# Altium schematic sheet [03] - 28PINSCHEMATIC.SchDoc (part 2 of 3)
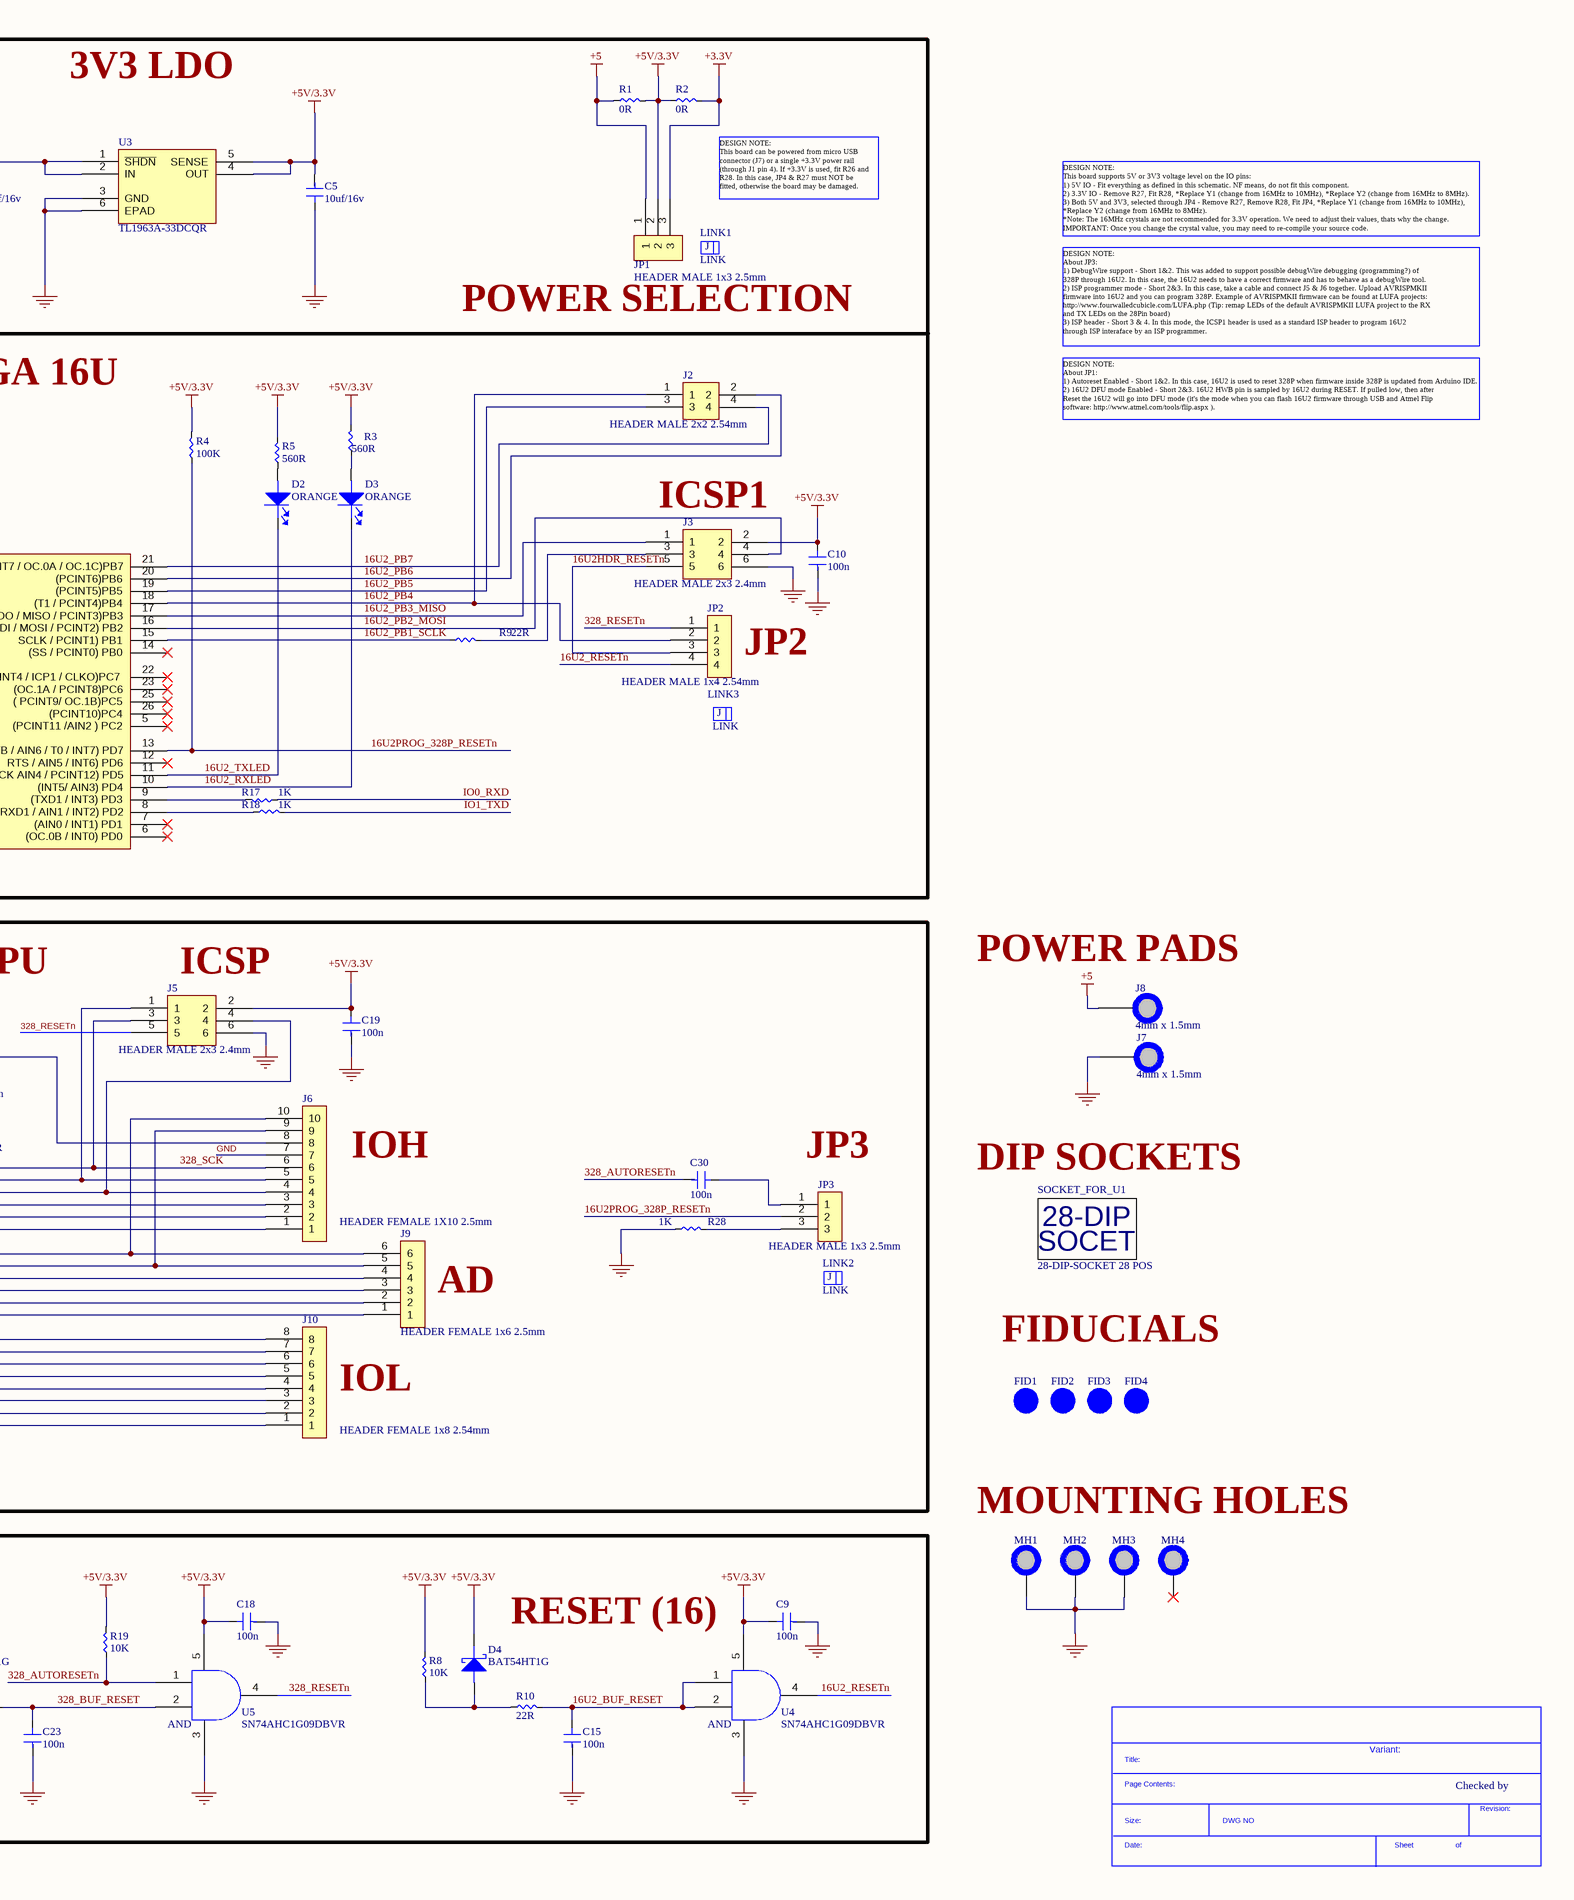
[diagram p2: [03] - 28PINSCHEMATIC.SchDoc, right]
## Library data of the parts
C1-C3 C7-C10 C14 C15 C18 C19 C21 C23-C25 C28-C32 = C2012X7R1H104M085AA: C Series 0805 0.1 uF 50 V ±20 % Tolerance X7R SMT Multilayer Ceramic Capacitor; Manufacturer: TDK; Capacitance: 100nF; Voltage Rating: 50V; Tolerance: 20%; Supplier 1: Digi-Key; Manufacturer Part Number: C2012X7R1H104M085AA; RoHS: Yes; Category: Ceramic Capacitors; Stock 1: 8415; Pricing 1: 1=0.13000, 10=0.09500, 50=0.05400, 100=0.04480, 500=0.03142, 1000=0.02601 (USD); Mount: Surface Mount; Case/Package: 0805; Number of Pins: 2; Case Code (Metric): 2012; Case Code (Imperial): 0805; Weight: 0.000194oz; Dielectric Material: Ceramic; Min Operating Temperature: -55°C; Max Operating Temperature: 125°C; Packaging: Tape and Reel; Package Quantity: 1; Voltage Rating (DC): 50V; Dielectric: X7R; Termination: SMD/SMT; Resistor Type: Ceramic; Series: C; Construction: Flat; Length: 2mm; Width: 0.049inch; Height: 0.85mm; Thickness: 0.037inch; Depth: 1.25mm; Lead Free: Lead Free; RoHS Compliant: Yes; ComponentLink1URL: https://datasheet.ciiva.com/6256/tdkmlcccaprange-6256917.pdf?src-supplier=Digi-Key; ComponentLink1Description: https://datasheet.ciiva.com/6256/tdkmlcccaprange-6256917.pdf?src-supplier=Digi-Key; ComponentLink2URL: https://datasheet.ciiva.com/6256/tdkmlcccaprange-6256919.pdf?src-supplier=Digi-Key; ComponentLink2Description: https://datasheet.ciiva.com/6256/tdkmlcccaprange-6256919.pdf?src-supplier=Digi-Key; Supplier Part Number 1: 445-7535-1-ND
C4-C6 C20 C22 = C2012X5R1C106M125AC: CERAMIC CAPACITOR, 10UF, 16V, X5R, 20%, 0805, FULL REEL; Product Range:C Series; Capacitance:10 F; Capacitance Tolerance: 20%; Dielectric Characteristic:X5R; Voltage Rating:16V; Ceramic Capacitor Case:0805 [2012 Metric]; MSL:- ;RoHS Compliant: Yes; Manufacturer: TDK; Supplier 1: Farnell; Manufacturer Part Number: C2012X5R1C106M125AC; RoHS: Yes; Category: Ceramic Capacitors; Pricing 1: 5=0.27200, 50=0.09480, 250=0.08030, 500=0.07090, 1000=0.06220, 2000=0.04880, 10000=0.04830, 20000=0.04180 (GBP); Mount: Surface Mount; Case/Package: 0805; Number of Pins: 2; Case Code (Metric): 2012; Case Code (Imperial): 0805; Weight: 0.000194oz; Dielectric Material: Ceramic; Min Operating Temperature: -55°C; Max Operating Temperature: 85°C; Capacitance: 10uF; Tolerance: 20%; Voltage Rating: 16V; Packaging: Tape and Reel; Package Quantity: 1; Voltage Rating (DC): 16V; Dielectric: X5R; Termination: SMD/SMT; Resistor Type: Ceramic; Series: C; Length: 0.079inch; Width: 0.049inch; Height: 1.25mm; Thickness: 0.057inch; Depth: 1.25mm; Lead Free: Lead Free; RoHS Compliant: Yes; ComponentLink1URL: https://datasheet.ciiva.com/23803/1796654-23803022.pdf?src-supplier=Newark; ComponentLink1Description: https://datasheet.ciiva.com/23803/1796654-23803022.pdf?src-supplier=Newark; ComponentLink2URL: https://datasheet.ciiva.com/22725/1913358-22725558.pdf?src-supplier=Element14; ComponentLink2Description: https://datasheet.ciiva.com/22725/1913358-22725558.pdf?src-supplier=Element14; ComponentLink3URL: https://datasheet.ciiva.com/6252/tdkmlcccaprange-6252105.pdf?src-supplier=Digi-Key; ComponentLink3Description: https://datasheet.ciiva.com/6252/tdkmlcccaprange-6252105.pdf?src-supplier=Digi-Key; ComponentLink4URL: https://datasheet.ciiva.com/6289/tdkmlcccaprange-6289238.pdf?src-supplier=Digi-Key; ComponentLink4Description: https://datasheet.ciiva.com/6289/tdkmlcccaprange-6289238.pdf?src-supplier=Digi-Key; ComponentLink5URL: https://datasheet.ciiva.com/6252/tdkmlcccaprange-6252108.pdf?src-supplier=Digi-Key; ComponentLink5Description: https://datasheet.ciiva.com/6252/tdkmlcccaprange-6252108.pdf?src-supplier=Digi-Key; Supplier Part Number 1: 2525134
C11 C12 = EEE-1CA101WP: Cap Aluminum 100uF 16V 20% (6.3 X 5.4mm) SMD 70mA 1000 hr 85°C T/R; Manufacturer: Panasonic; Life (Hours): 1000Hour; Leakage Current: 3uA; Supplier 1: Future Electronics; Manufacturer Part Number: EEE-1CA101WP; RoHS: Yes; Category: Aluminum Electrolytic Capacitors; Stock 1: 49000; Pricing 1: 1000=0.12400, 3000=0.12100, 5000=0.11900, 15000=0.11500, 25000=0.11200 (USD); Mount: Surface Mount,PCB; Case/Package: Radial; Contact Plating: Tin; Min Operating Temperature: -40°C; Max Operating Temperature: 85°C; Capacitance: 100uF; Tolerance: 20%; Voltage Rating: 16V; Ripple Current: 70mA; Voltage Rating (DC): 16V; Packaging: Tape and Reel; Package Quantity: 1000; Ripple Current (AC): 70mA; Termination: SMD/SMT; Voltage: 16V; Series: S; Construction: Cylindrical; Diameter: 6.3mm; Length: 5.5mm; Height: 5.4mm; Height - Seated (Max): 0.213inch; Ratings: AEC-Q200; Radiation Hardening: No; Lead Free: Lead Free; RoHS Compliant: Yes; ComponentLink1URL: https://datasheet.ciiva.com/36525/1355583-36525976.pdf?src-supplier=Jameco; ComponentLink1Description: https://datasheet.ciiva.com/36525/1355583-36525976.pdf?src-supplier=Jameco; ComponentLink2URL: https://datasheet.ciiva.com/24022/aba0000ce2-40801-24022853.pdf?src-supplier=Mouser; ComponentLink2Description: https://datasheet.ciiva.com/24022/aba0000ce2-40801-24022853.pdf?src-supplier=Mouser; ComponentLink3URL: https://datasheet.ciiva.com/14600/70255710-14600124.pdf?src-supplier=Allied+Electronics; ComponentLink3Description: https://datasheet.ciiva.com/14600/70255710-14600124.pdf?src-supplier=Allied+Electronics; ComponentLink4URL: https://datasheet.ciiva.com/11680/aba0000ce2-11680765.pdf?src-supplier=Avnet; ComponentLink4Description: https://datasheet.ciiva.com/11680/aba0000ce2-11680765.pdf?src-supplier=Avnet; ComponentLink5URL: https://datasheet.ciiva.com/2983/aba0000ce2-2983909.pdf?src-supplier=Avnet; ComponentLink5Description: https://datasheet.ciiva.com/2983/aba0000ce2-2983909.pdf?src-supplier=Avnet; ComponentLink6URL: https://datasheet.ciiva.com/30194/11aba0000ce2-30194491.pdf?src-supplier=Onlinecomponents.com; ComponentLink6Description: https://datasheet.ciiva.com/30194/11aba0000ce2-30194491.pdf?src-supplier=Onlinecomponents.com; Supplier Part Number 1: 7028587
C13 = C2012X5R1E105K125AA: CAP CER 1UF 25V X5R 0805; Manufacturer: TDK; Dielectric Material: Ceramic; Tolerance: 10%; Supplier 1: Arrow Electronics; Manufacturer Part Number: C2012X5R1E105K125AA; RoHS: Yes; Category: Ceramic Capacitors; Stock 1: 86000; Pricing 1: 2000=0.03530, 4000=0.03050, 10000=0.02970, 14000=0.02630, 50000=0.02620 (USD); Mount: Surface Mount; Case/Package: 0805; Number of Pins: 2; Case Code (Metric): 2012; Case Code (Imperial): 0805; Weight: 0.000194oz; Min Operating Temperature: -55°C; Max Operating Temperature: 85°C; Package Quantity: 2000; Capacitance: 1uF; Voltage Rating: 25V; Packaging: Tape and Reel; Voltage Rating (DC): 25V; Dielectric: X5R; Termination: SMD/SMT; Resistor Type: Ceramic; Voltage: 25V; Series: C; Construction: Flat; Length: 2mm; Width: 0.049inch; Height: 1.25mm; Thickness: 0.057inch; Depth: 1.25mm; Radiation Hardening: No; Reach SVHC Compliant: Yes; Lead Free: Lead Free; RoHS Compliant: Yes; ComponentLink1URL: https://datasheet.ciiva.com/16449/e412-c-16449595.pdf?src-supplier=Future+Electronics; ComponentLink1Description: https://datasheet.ciiva.com/16449/e412-c-16449595.pdf?src-supplier=Future+Electronics; ComponentLink2URL: https://datasheet.ciiva.com/28602/1744655-28602171.pdf?src-supplier=Element14; ComponentLink2Description: https://datasheet.ciiva.com/28602/1744655-28602171.pdf?src-supplier=Element14; ComponentLink3URL: https://datasheet.ciiva.com/15192/getdatasheetpartid-726707-15192140.pdf?src-supplier=Verical; ComponentLink3Description: https://datasheet.ciiva.com/15192/getdatasheetpartid-726707-15192140.pdf?src-supplier=Verical; Supplier Part Number 1: C2012X5R1E105K125AA
C16 C17 C26 C27 = C0805C180J5GACAUTO: .050 X .050 C.L. FEMALE IDC ASSE; Manufacturer: KEMET; Supplier 1: Digi-Key; Manufacturer Part Number: C0805C180J5GACAUTO; RoHS: Yes; Category: Ceramic Capacitors; Stock 1: 1163; Pricing 1: 1=0.18000, 10=0.12600, 50=0.07160, 100=0.05930, 500=0.04158, 1000=0.03443 (USD); RoHS Compliant: Yes; Supplier Part Number 1: 399-C0805C180J5GACAUTOCT-ND
D1 = LSL29K-G1J2-1-Z: Smartled Red Clear Lc; Manufacturer: Osram Opto; Lens Color: White,Colorless; Lens Style: Flat,Diffused,Colorless,Rectangular; Viewing Angle: 160°; Forward Current: 20mA; Forward Voltage: 2.2V; Luminous Intensity: 7.1mcd; Test Current: 2mA; Dominant Wavelength: 630nm; Luminous Flux: 0.017lm; Number of LEDs: 1; Reverse Voltage: 12V; Lens Transparency: Diffused; Lens Size: 0.8mm; Supplier 1: Avnet; Manufacturer Part Number: LSL29K-G1J2-1-Z; RoHS: Yes; Category: LEDs; Pricing 1: 15000=0.06572, 25000=0.06405, 40000=0.06237, 75000=0.06070, 150000=0.05902, 750000=0.05735, 1500000=0.05567 (USD); Mount: Surface Mount; Case/Package: 0603; Number of Pins: 2; Color: Red; Case Code (Metric): 1608; Case Code (Imperial): 0603; Contact Plating: Tin,Matte; Min Operating Temperature: -40°C; Max Operating Temperature: 100°C; Package Quantity: 5000; Packaging: Tape and Reel; Illumination Color: Red; Series: SMARTLED® 0603; Number of Elements: 1; Length: 1.7mm; Width: 0.8mm; Height: 0.65mm; Depth: 0.8mm; Radiation Hardening: No; ComponentLink1URL: https://datasheet.ciiva.com/2112/00077099-0-2112845.pdf?src-supplier=Digi-Key; ComponentLink1Description: https://datasheet.ciiva.com/2112/00077099-0-2112845.pdf?src-supplier=Digi-Key; ComponentLink2URL: https://datasheet.ciiva.com/2112/00077099-0-2112844.pdf?src-supplier=Digi-Key; ComponentLink2Description: https://datasheet.ciiva.com/2112/00077099-0-2112844.pdf?src-supplier=Digi-Key; ComponentLink3URL: https://datasheet.ciiva.com/2112/00077099-0-2112846.pdf?src-supplier=Digi-Key; ComponentLink3Description: https://datasheet.ciiva.com/2112/00077099-0-2112846.pdf?src-supplier=Digi-Key; Supplier Part Number 1: Q65110A1757
D2 D3 D6 = SML-311DTT86: ROHM SML-311DTT86; SML-31 Series Orange LED; 605 nm 1608(0603); Rectangle Lens; Lens Color: Colorless,Clear; Forward Current: 2mA; Forward Voltage: 1.8V; Luminous Intensity: 2.5mcd; Viewing Angle: 140°; Lens Style: Diffused,Colorless,Rectangular,Clear; Dominant Wavelength: 605nm; Lens Transparency: Clear; Wavelength: 611nm; Number of LEDs: 1; Supplier 1: Digi-Key; Manufacturer: Rohm; Manufacturer Part Number: SML-311DTT86; RoHS: Yes; Category: LEDs; Stock 1: 44311; Pricing 1: 1=0.40000, 10=0.26200, 100=0.17510, 500=0.12112, 1000=0.10094 (USD); Mount: Surface Mount; Case/Package: 0603; Number of Pins: 2; Color: Orange; Case Code (Metric): 1608; Case Code (Imperial): 0603; Min Operating Temperature: -30°C; Max Operating Temperature: 85°C; Package Quantity: 1; Illumination Color: Orange; Packaging: Tape and Reel; Test Current: 2mA; Series: -; Length: 1.6mm; Width: 0.8mm; Height: 0.9mm; Radiation Hardening: No; Lead Free: Lead Free; RoHS Compliant: Yes; ComponentLink1URL: https://datasheet.ciiva.com/11774/0900766b80df3a77-11774225.pdf?src-supplier=Rs; ComponentLink1Description: https://datasheet.ciiva.com/11774/0900766b80df3a77-11774225.pdf?src-supplier=Rs; ComponentLink2URL: https://datasheet.ciiva.com/2110/sml-311series-2110838.pdf?src-supplier=Digi-Key; ComponentLink2Description: https://datasheet.ciiva.com/2110/sml-311series-2110838.pdf?src-supplier=Digi-Key; ComponentLink3URL: https://datasheet.ciiva.com/2110/sml-311series-2110839.pdf?src-supplier=Digi-Key; ComponentLink3Description: https://datasheet.ciiva.com/2110/sml-311series-2110839.pdf?src-supplier=Digi-Key; ComponentLink4URL: https://datasheet.ciiva.com/2110/sml-311series-2110840.pdf?src-supplier=Digi-Key; ComponentLink4Description: https://datasheet.ciiva.com/2110/sml-311series-2110840.pdf?src-supplier=Digi-Key; ComponentLink5URL: https://datasheet.ciiva.com/16388/sml-31-16388237.pdf?src-supplier=Future+Electronics; ComponentLink5Description: https://datasheet.ciiva.com/16388/sml-31-16388237.pdf?src-supplier=Future+Electronics; Supplier Part Number 1: 511-1303-1-ND
D4 D5 = BAT54HT1G: Diode Schottky 30V 200MA SOD323; Manufacturer: Rochester Electronics; Polarity: Standard; Capacitance: 10pF; Supplier 1: DigiKey Marketplace; Manufacturer Part Number: BAT54HT1G; Category: Rectifier Diodes; Pricing 1: 1=1.00000 (USD); Number of Pins: 2; Packaging: Bulk; Voltage Rating (DC): 30V; Current Rating: 200mA; Output Current: 200mA; Reach SVHC Compliant: Yes; Lead Free: Lead Free; Halogen Free: Halogen Free; Supplier Part Number 1: 2156-BAT54HT1G-ND
FB1-FB3 = MPZ2012S221AT000: 0805 ±25% 220Ω @100MHz 3A 40mΩ; Manufacturer: TDK; Core Material: Ferrite; Impedance: 220R; DC Resistance (DCR): 40mR; Test Frequency: 100MHz; Number of Lines: 1; Supplier 1: Digi-Key; Manufacturer Part Number: MPZ2012S221AT000; RoHS: Yes; Category: Ferrite Beads and Chips; Pricing 1: 1=0.11000, 10=0.09200, 25=0.08320, 50=0.06100, 100=0.05270, 250=0.04160, 500=0.03512, 1000=0.02957 (USD); Mount: Surface Mount; Case/Package: 0805; Case Code (Metric): 2012; Case Code (Imperial): 0805; Weight: 0.000194oz; Min Operating Temperature: -55°C; Max Operating Temperature: 125°C; Packaging: Tape and Reel; Package Quantity: 1; Current Rating: 3A; Tolerance: 25%; Max DC Current: 3A; Termination: SMD/SMT; Series: MPZ; Max Current Rating: 3A; Length: 0.079inch; Width: 0.049inch; Height: 0.85mm; Depth: 1.25mm; Reach SVHC Compliant: Yes; Lead Free: Lead Free; RoHS Compliant: Yes; ComponentLink1URL: https://datasheet.ciiva.com/46381/1750041-46381647.pdf?src-supplier=Element14; ComponentLink1Description: https://datasheet.ciiva.com/46381/1750041-46381647.pdf?src-supplier=Element14; ComponentLink2URL: https://datasheet.ciiva.com/46634/beads-commercial-power-mpz-en-46634582.pdf?src-supplier=Digi-Key; ComponentLink2Description: https://datasheet.ciiva.com/46634/beads-commercial-power-mpz-en-46634582.pdf?src-supplier=Digi-Key; ComponentLink3URL: https://datasheet.ciiva.com/46634/beads-commercial-power-mpz-en-46634586.pdf?src-supplier=Digi-Key; ComponentLink3Description: https://datasheet.ciiva.com/46634/beads-commercial-power-mpz-en-46634586.pdf?src-supplier=Digi-Key; ComponentLink4URL: https://datasheet.ciiva.com/48682/beads-commercial-power-mpz-en-48682507.pdf?src-supplier=Avnet; ComponentLink4Description: https://datasheet.ciiva.com/48682/beads-commercial-power-mpz-en-48682507.pdf?src-supplier=Avnet; Supplier Part Number 1: 445-MPZ2012S221AT000DKR-ND
FID1-FID4 = Fit 1mm: Fiducial 40mm Diameter 120mil Mask
J1 J10 = M20-7820842: 2.54mm (0.1") Pitch SIL Vertical PC Tail Socket Assembly, selective gold + tin, 8 contacts; Manufacturer: Harwin; Number of Positions: 8; Connector Type: Receptacle; Max Current Rating: 3A; Contact Resistance: 20mR; Supplier 1: Mouser; Manufacturer Part Number: M20-7820842; RoHS: Yes; Category: Headers and Wire Housings; Stock 1: 3750; Pricing 1: 1=1.43000, 10=1.15000, 50=1.15000, 100=1.15000, 1000=0.88300, 10000=0.68700 (USD); Mount: Through Hole; Case/Package: SIL; Contact Plating: Tin,Gold; Color: Black; Contact Material: Bronze; Housing Material: Polyamide; Housing Color: Black; Weight: 0.025397oz; Min Operating Temperature: -40°C; Max Operating Temperature: 105°C; Number of Rows: 1; Package Quantity: 29; Packaging: Rail/Tube; Termination: Solder; Number of Contacts: 8; Orientation: Straight; Gender: Female; Series: M20; Contact Type: Female Socket; Contact Gender: Female; Length: 20.72mm; Pitch: 2.54mm; Depth: 2.5mm; Radiation Hardening: No; RoHS Compliant: Yes; ComponentLink1URL: https://datasheet.ciiva.com/9480/m20-782-9480074.pdf?src-supplier=Avnet; ComponentLink1Description: https://datasheet.ciiva.com/9480/m20-782-9480074.pdf?src-supplier=Avnet; Supplier Part Number 1: 855-M20-7820842
J2 = 68602-204HLF: Conn Unshrouded Header HDR 4 POS 2.54mm Solder ST Top Entry Thru-Hole BergStik® Bulk; Manufacturer: Amphenol ICC; Supplier 1: Mouser; Manufacturer Part Number: 68602-204HLF; RoHS: Yes; Supplier Part Number 1: 649-68602-204HLF
J3 J5 = 67997-106HLF: Conn Unshrouded Header HDR 6 POS 2.54mm Solder ST Top Entry Thru-Hole BergStik® Bulk; Manufacturer: Amphenol ICC / FCI; Supplier 1: Avnet; Manufacturer Part Number: 67997-106HLF; RoHS: No; Category: Headers and Wire Housings; Stock 1: 8823; ComponentLink1URL: http://uk.rs-online.com/webdocs/1450/0900766b81450b8b.pdf?src-supplier=Rs; ComponentLink1Description: http://uk.rs-online.com/webdocs/1450/0900766b81450b8b.pdf?src-supplier=Rs; ComponentLink2URL: https://cdn.amphenol-icc.com/media/wysiwyg/files/drawing/67996.pdf?src-supplier=Onlinecomponents.com; ComponentLink2Description: https://cdn.amphenol-icc.com/media/wysiwyg/files/drawing/67996.pdf?src-supplier=Onlinecomponents.com; ComponentLink3URL: https://cdn.amphenol-icc.com/media/wysiwyg/files/drawing/67996.pdf?src-supplier=Digi-Key; ComponentLink3Description: https://cdn.amphenol-icc.com/media/wysiwyg/files/drawing/67996.pdf?src-supplier=Digi-Key; ComponentLink4URL: http://components.arrow.com/part/dataview/41913658S7633350N8314?src-supplier=Arrow+Electronics; ComponentLink4Description: http://components.arrow.com/part/dataview/41913658S7633350N8314?src-supplier=Arrow+Electronics; ComponentLink5URL: http://www.farnell.com/datasheets/1876884.pdf?src-supplier=Newark; ComponentLink5Description: http://www.farnell.com/datasheets/1876884.pdf?src-supplier=Newark; ComponentLink6URL: https://cdn.amphenol-icc.com/media/wysiwyg/files/drawing/67996.pdf?src-supplier=Allied+Electronics; ComponentLink6Description: https://cdn.amphenol-icc.com/media/wysiwyg/files/drawing/67996.pdf?src-supplier=Allied+Electronics; ComponentLink7URL: https://cdn.amphenol-icc.com/media/wysiwyg/files/drawing/67996.pdf?src-supplier=Mouser; ComponentLink7Description: https://cdn.amphenol-icc.com/media/wysiwyg/files/drawing/67996.pdf?src-supplier=Mouser; ComponentLink8URL: http://www.farnell.com/datasheets/1876884.pdf?src-supplier=Farnell; ComponentLink8Description: http://www.farnell.com/datasheets/1876884.pdf?src-supplier=Farnell; ComponentLink9URL: https://cdn.amphenol-icc.com/media/wysiwyg/files/drawing/67996.pdf?src-supplier=Avnet; ComponentLink9Description: https://cdn.amphenol-icc.com/media/wysiwyg/files/drawing/67996.pdf?src-supplier=Avnet; ComponentLink10URL: https://cdn.amphenol-icc.com/media/wysiwyg/files/drawing/67996.pdf?src-supplier=TTI; ComponentLink10Description: https://cdn.amphenol-icc.com/media/wysiwyg/files/drawing/67996.pdf?src-supplier=TTI; ComponentLink11URL: https://cdn.amphenol-icc.com/media/wysiwyg/files/drawing/67996.pdf?src-supplier=Heilind+Electronics; ComponentLink11Description: https://cdn.amphenol-icc.com/media/wysiwyg/files/drawing/67996.pdf?src-supplier=Heilind+Electronics; Supplier Part Number 1: 67997-106HLF
J4 = 10118193-0001LF: FCI Right Angle Surface Mount Mount Female USB Connector; 100 V ac; 1.8A; Manufacturer: Amphenol ICC / FCI; Supplier 1: Rs; Manufacturer Part Number: 10118193-0001LF; RoHS: No; Category: USB Connectors; Stock 1: 1; ComponentLink1URL: http://uk.rs-online.com/webdocs/1450/0900766b814507f1.pdf?src-supplier=Rs; ComponentLink1Description: http://uk.rs-online.com/webdocs/1450/0900766b814507f1.pdf?src-supplier=Rs; ComponentLink2URL: http://www.amphenol-icc.com/media/wysiwyg/files/drawing/10118193.pdf?src-supplier=Digi-Key; ComponentLink2Description: http://www.amphenol-icc.com/media/wysiwyg/files/drawing/10118193.pdf?src-supplier=Digi-Key; ComponentLink3URL: https://cdn.amphenol-icc.com/media/wysiwyg/files/documentation/datasheet/inputoutput/io_usb_micro.pdf?src-supplier=Digi-Key; ComponentLink3Description: https://cdn.amphenol-icc.com/media/wysiwyg/files/documentation/datasheet/inputoutput/io_usb_micro.pdf?src-supplier=Digi-Key; ComponentLink4URL: https://cdn.amphenol-icc.com/media/wysiwyg/files/documentation/datasheet/inputoutput/io_usb_micro.pdf?src-supplier=Onlinecomponents.com; ComponentLink4Description: https://cdn.amphenol-icc.com/media/wysiwyg/files/documentation/datasheet/inputoutput/io_usb_micro.pdf?src-supplier=Onlinecomponents.com; ComponentLink5URL: https://cdn.amphenol-icc.com/media/wysiwyg/files/documentation/datasheet/inputoutput/io_usb_micro.pdf?src-supplier=Verical; ComponentLink5Description: https://cdn.amphenol-icc.com/media/wysiwyg/files/documentation/datasheet/inputoutput/io_usb_micro.pdf?src-supplier=Verical; ComponentLink6URL: https://cdn.amphenol-icc.com/media/wysiwyg/files/documentation/datasheet/inputoutput/io_usb_micro.pdf?src-supplier=Allied+Electronics; ComponentLink6Description: https://cdn.amphenol-icc.com/media/wysiwyg/files/documentation/datasheet/inputoutput/io_usb_micro.pdf?src-supplier=Allied+Electronics; ComponentLink7URL: https://cdn.amphenol-icc.com/media/wysiwyg/files/documentation/datasheet/inputoutput/io_usb_micro.pdf?src-supplier=Mouser; ComponentLink7Description: https://cdn.amphenol-icc.com/media/wysiwyg/files/documentation/datasheet/inputoutput/io_usb_micro.pdf?src-supplier=Mouser; ComponentLink8URL: https://cdn.amphenol-icc.com/media/wysiwyg/files/documentation/datasheet/inputoutput/io_usb_micro.pdf?src-supplier=Avnet; ComponentLink8Description: https://cdn.amphenol-icc.com/media/wysiwyg/files/documentation/datasheet/inputoutput/io_usb_micro.pdf?src-supplier=Avnet; ComponentLink9URL: https://cdn.amphenol-icc.com/media/wysiwyg/files/documentation/datasheet/inputoutput/io_usb_micro.pdf?src-supplier=Arrow+Electronics; ComponentLink9Description: https://cdn.amphenol-icc.com/media/wysiwyg/files/documentation/datasheet/inputoutput/io_usb_micro.pdf?src-supplier=Arrow+Electronics; ComponentLink10URL: https://cdn.amphenol-icc.com/media/wysiwyg/files/documentation/datasheet/inputoutput/io_usb_micro.pdf?src-supplier=Rs; ComponentLink10Description: https://cdn.amphenol-icc.com/media/wysiwyg/files/documentation/datasheet/inputoutput/io_usb_micro.pdf?src-supplier=Rs; ComponentLink11URL: https://cdn.amphenol-icc.com/media/wysiwyg/files/documentation/datasheet/inputoutput/io_usb_micro.pdf?src-supplier=TTI; ComponentLink11Description: https://cdn.amphenol-icc.com/media/wysiwyg/files/documentation/datasheet/inputoutput/io_usb_micro.pdf?src-supplier=TTI; ComponentLink12URL: https://cdn.amphenol-icc.com/media/wysiwyg/files/documentation/datasheet/inputoutput/io_usb_micro.pdf?src-supplier=TME; ComponentLink12Description: https://cdn.amphenol-icc.com/media/wysiwyg/files/documentation/datasheet/inputoutput/io_usb_micro.pdf?src-supplier=TME; ComponentLink13URL: https://cdn.amphenol-icc.com/media/wysiwyg/files/documentation/datasheet/inputoutput/io_usb_micro.pdf?src-supplier=Heilind+Electronics; ComponentLink13Description: https://cdn.amphenol-icc.com/media/wysiwyg/files/documentation/datasheet/inputoutput/io_usb_micro.pdf?src-supplier=Heilind+Electronics; Supplier Part Number 1: 8632989
J6 = M20-7821046: 2.54mm (0.1") Pitch SIL Vertical PC Tail Socket Assembly, tin, 10 contacts; Manufacturer: Harwin; Current Rating: 3A; Connector Type: Receptacle; Number of Positions: 10; Contact Resistance: 20mR; Insulation Resistance: 1MR; Voltage Rating: 1kV; Mating Cycles: 50; Mated Stacking Heights: 12.63mm; Hole Diameter: 0.8mm; Supplier 1: Rs; Manufacturer Part Number: M20-7821046; RoHS: Yes; Category: Headers and Wire Housings; Stock 1: 515; Mount: Through Hole; Case/Package: SIL; Color: Black; Contact Plating: Tin; Contact Material: Bronze; Housing Material: Nylon; Housing Color: Black; Contact Finish - Mating: TIN; Insulation Color: Black; Insulation Material: Nylon; Contact Shape: Square; Min Operating Temperature: -40°C; Max Operating Temperature: 105°C; Packaging: Rail/Tube; Number of Rows: 1; Package Quantity: 23; Termination: Solder; Number of Contacts: 10; Gender: Receptacle; Series: M20; Contact Type: Female Socket; Max Current Rating: 3A; Orientation: Straight; Fastening Type: Pull; Contact Gender: Female; Length: 25.8mm; Pitch: 2.54mm; Depth: 2.5mm; Lead Pitch: 2.54mm; Radiation Hardening: No; RoHS Compliant: Yes; Reach SVHC Compliant: Yes; Flammability Rating: UL94 V-0; ComponentLink1URL: https://datasheet.ciiva.com/26899/getdatasheetpartid-559226-26899379.pdf?src-supplier=Verical; ComponentLink1Description: https://datasheet.ciiva.com/26899/getdatasheetpartid-559226-26899379.pdf?src-supplier=Verical; ComponentLink2URL: https://datasheet.ciiva.com/11753/0900766b80dc1d2b-11753869.pdf?src-supplier=Rs; ComponentLink2Description: https://datasheet.ciiva.com/11753/0900766b80dc1d2b-11753869.pdf?src-supplier=Rs; ComponentLink3URL: https://datasheet.ciiva.com/6785/m20-782-6785605.pdf?src-supplier=Digi-Key; ComponentLink3Description: https://datasheet.ciiva.com/6785/m20-782-6785605.pdf?src-supplier=Digi-Key; ComponentLink4URL: https://datasheet.ciiva.com/10151/m20-782-10151366.pdf?src-supplier=Avnet; ComponentLink4Description: https://datasheet.ciiva.com/10151/m20-782-10151366.pdf?src-supplier=Avnet; Supplier Part Number 1: 6816826
J7 J8 = PAD_WITH_HOLE_4mmx1.5mm: pad with hole 4mm x 1.5mm
J9 = M20-7820642: 2.54mm (0.1") Pitch SIL Vertical PC Tail Socket Assembly, selective gold + tin, 6 contacts; Manufacturer: Harwin; Max Current Rating: 3A; Contact Resistance: 20mR; Connector Type: Receptacle,Socket; Number of Positions: 6; Supplier 1: Digi-Key; Manufacturer Part Number: M20-7820642; RoHS: Yes; Category: Headers and Wire Housings; Stock 1: 2282; Pricing 1: 1=1.28000, 10=1.07900, 100=0.96880, 500=0.79264, 1000=0.70458, 5000=0.61650, 10000=0.58568 (USD); Mount: Through Hole; Case/Package: SIL; Contact Plating: Gold,Tin; Color: Black; Contact Material: Bronze; Weight: 0.019048oz; Housing Color: Black; Housing Material: Nylon; Min Operating Temperature: -40°C; Max Operating Temperature: 105°C; Gender: Female; Contact Gender: Female; Package Quantity: 38; Number of Rows: 1; Packaging: Rail/Tube; Orientation: Straight; Termination: Solder; Number of Contacts: 6; Length: 15.64mm; Pitch: 2.54mm; Depth: 2.5mm; ComponentLink1URL: http://www.mouser.com/ds/2/181/Harwin_Product_Catalog_page_197-1134272.pdf?src-supplier=Mouser; ComponentLink1Description: http://www.mouser.com/ds/2/181/Harwin_Product_Catalog_page_197-1134272.pdf?src-supplier=Mouser; ComponentLink2URL: https://cdn.harwin.com/pdfs/M20-782.pdf?src-supplier=Digi-Key; ComponentLink2Description: https://cdn.harwin.com/pdfs/M20-782.pdf?src-supplier=Digi-Key; ComponentLink3URL: http://www.harwin.com/include/downloads/pdfs/60PAGE140.PDF?src-supplier=Avnet; ComponentLink3Description: http://www.harwin.com/include/downloads/pdfs/60PAGE140.PDF?src-supplier=Avnet; Supplier Part Number 1: 952-1808-ND
JP1 JP3 = 68000-303HLF: Conn Unshrouded Header HDR 3 POS 2.54mm Solder ST Thru-Hole Bag; Manufacturer: Amphenol ICC / FCI; Supplier 1: Avnet; Manufacturer Part Number: 68000-303HLF; RoHS: Yes; Category: Connectors; Pricing 1: 16000=0.12586 (USD); ComponentLink1URL: https://datasheet.ciiva.com/29130/68000-29130875.pdf?src-supplier=Digi-Key; ComponentLink1Description: https://datasheet.ciiva.com/29130/68000-29130875.pdf?src-supplier=Digi-Key; Supplier Part Number 1: 68000-303HLF
JP2 = 68004-204HLF: Conn Unshrouded Header HDR 4 POS 2.54mm Solder ST Thru-Hole Bag; Manufacturer: Amphenol ICC / FCI; Supplier 1: Mouser; Manufacturer Part Number: 68004-204HLF; RoHS: Yes; Category: Headers and Wire Housings; Pricing 1: 1=0.48000, 10=0.40000, 50=0.40000, 100=0.34300, 1000=0.24600, 10000=0.19800 (USD); ComponentLink1URL: https://datasheet.ciiva.com/10144/68000-10144646.pdf?src-supplier=Avnet; ComponentLink1Description: https://datasheet.ciiva.com/10144/68000-10144646.pdf?src-supplier=Avnet; Supplier Part Number 1: 649-68004-204HLF
L1 = L1210R2R2MDWIT: Inductor RF Chip Wirewound 2.2uH 20% 100KHz 1.13A 0.104Ohm DCR 1210 T/R; Manufacturer: KEMET; Core Material: Ferrite; Current Rating: 2A; Shielding: Unshielded; Self Resonant Frequency: 190MHz; DC Resistance (DCR): 80mR; Supplier 1: Mouser; Manufacturer Part Number: L1210R2R2MDWIT; RoHS: Yes; Category: Fixed Inductors; Stock 1: 15045; Pricing 1: 1=0.48000, 10=0.33100, 50=0.33100, 100=0.28300, 1000=0.20400, 10000=0.18000 (USD); Mount: Surface Mount; Case/Package: 1210; Case Code (Metric): 3225; Case Code (Imperial): 1210; Min Operating Temperature: -40°C; Max Operating Temperature: 105°C; Package Quantity: 1000; Tolerance: 20%; Packaging: Tape and Reel; Inductance Tolerance: 20%; Resistor Type: Wirewound,Ceramic; Inductance: 2.2uH; Test Frequency: 100kHz; Max DC Current: 2A; Termination: SMD/SMT; DC Current: 1.13A; Series: L-DWI; Length: 3.2mm; Width: 2.5mm; Height: 2.5mm; Height - Seated (Max): 0.106inch; Depth: 2.7mm; Radiation Hardening: No; Reach SVHC Compliant: Yes; Military Standard: Not; RoHS Compliant: Yes; ComponentLink1URL: https://datasheet.ciiva.com/4957/f3115-4957838.pdf?src-supplier=Mouser; ComponentLink1Description: https://datasheet.ciiva.com/4957/f3115-4957838.pdf?src-supplier=Mouser; ComponentLink2URL: https://datasheet.ciiva.com/6691/f3115-6691487.pdf?src-supplier=Digi-Key; ComponentLink2Description: https://datasheet.ciiva.com/6691/f3115-6691487.pdf?src-supplier=Digi-Key; ComponentLink3URL: https://datasheet.ciiva.com/8512/f3115-8512543.pdf?src-supplier=Avnet; ComponentLink3Description: https://datasheet.ciiva.com/8512/f3115-8512543.pdf?src-supplier=Avnet; ComponentLink4URL: https://datasheet.ciiva.com/22685/27262-22685038.pdf?src-supplier=Element14; ComponentLink4Description: https://datasheet.ciiva.com/22685/27262-22685038.pdf?src-supplier=Element14; Supplier Part Number 1: 80-L1210R2R2MDWIT
LINK1-LINK3 = QPC02SXGN-RC: 2 Position 2.54 mm Centerline Single Circuit Open Top Jumper; Manufacturer: Sullins; Supplier 1: Future Electronics; Manufacturer Part Number: QPC02SXGN-RC; RoHS: Yes; Category: Connectors; Stock 1: 10325; Pricing 1: 1=0.02850, 1500=0.02750, 5000=0.02640, 15000=0.02540, 50000=0.02350 (USD); ComponentLink1URL: https://datasheet.ciiva.com/767/284-sxgn-11510-767869.pdf?src-supplier=Digi-Key; ComponentLink1Description: https://datasheet.ciiva.com/767/284-sxgn-11510-767869.pdf?src-supplier=Digi-Key; Supplier Part Number 1: 8009030
MH1-MH3 = MH_7.4mm_3.2mm
R1 R2 R6 R13 = RC0805JR-070RL: Surface Mount Thick Film Resistor, RC Series, 125 mW, - 5%, 150 V, 0805 [2012 Metric]; Manufacturer: Yageo; Resistance: 0mR; Voltage Rating: 150V; Power Rating: 125mW; Temperature Coefficient: 200ppm/°C; Supplier 1: Future Electronics; Manufacturer Part Number: RC0805JR-070RL; RoHS: Yes; Category: Chip SMD Resistors; Stock 1: 21150000; Pricing 1: 5000=0.00280, 25000=0.00270, 125000=0.00250, 375000=0.00240, 1000000=0.00220 (USD); Case/Package: 0805; Number of Pins: 2; Case Code (Imperial): 0805; Case Code (Metric): 2012; Contact Plating: Tin,Matte; Size Code: 0805; Min Operating Temperature: -55°C; Max Operating Temperature: 155°C; Packaging: Tape and Reel; Tolerance: 5%; Voltage Rating (DC): 150V; Termination: SMD/SMT; Resistor Type: Thick Film; Features: Moisture Resistant; Series: RC; Max Power Dissipation: 125mW; Number of Terminations: 2; Construction: Rectangular; Technology: THICK FILM; Resistance Tolerance: 5%; Length: 2mm; Width: 1.25mm; Height: 0.5mm; Depth: 1.25mm; Radiation Hardening: No; Military Standard: Not; Lead Free: Lead Free; RoHS Compliant: Yes; Supplier Part Number 1: 2506467
R3 R5 R7 R26 R29 = RC0805FR-07560RL: Res General Purpose Thick Film 0805 560 Ohm 1% 1/8W ±100ppm/°C Molded Paper T/R; Manufacturer: Yageo; Power Rating: 125mW; Voltage Rating: 150V; Supplier 1: Future Electronics; Manufacturer Part Number: RC0805FR-07560RL; RoHS: Yes; Category: Chip SMD Resistors; Stock 1: 245000; Pricing 1: 5000=0.00250, 25000=0.00230, 125000=0.00220, 500000=0.00210, 1250000=0.00190 (USD); Case/Package: 0805; Case Code (Metric): 2012; Case Code (Imperial): 0805; Weight: 0.000194oz; Size Code: 0805; Min Operating Temperature: -55°C; Max Operating Temperature: 155°C; Tolerance: 1%; Resistance: 560R; Packaging: Cut Tape; Temperature Coefficient: 100ppm/°C; Package Quantity: 1; Resistor Type: Thick Film; Number of Terminations: 2; Termination: SMD/SMT; Max Power Dissipation: 125mW; Features: Moisture Resistant; Series: RC; Resistance Tolerance: 1%; Construction: Rectangular; Length: 0.079inch; Width: 0.049inch; Height: 0.024inch; Depth: 1.25mm; Lead Free: Lead Free; Military Standard: Not; RoHS Compliant: Yes; ComponentLink1URL: https://datasheet.ciiva.com/2457/pyu-r-int-thick-7-2457141.pdf?src-supplier=Digi-Key; ComponentLink1Description: https://datasheet.ciiva.com/2457/pyu-r-int-thick-7-2457141.pdf?src-supplier=Digi-Key; ComponentLink2URL: https://datasheet.ciiva.com/2457/pyu-r-int-thick-7-2457142.pdf?src-supplier=Digi-Key; ComponentLink2Description: https://datasheet.ciiva.com/2457/pyu-r-int-thick-7-2457142.pdf?src-supplier=Digi-Key; ComponentLink3URL: https://datasheet.ciiva.com/2457/pyu-r-int-thick-7-2457140.pdf?src-supplier=Digi-Key; ComponentLink3Description: https://datasheet.ciiva.com/2457/pyu-r-int-thick-7-2457140.pdf?src-supplier=Digi-Key; ComponentLink4URL: https://datasheet.ciiva.com/5561/rc0805-5561861.pdf?src-supplier=Mouser; ComponentLink4Description: https://datasheet.ciiva.com/5561/rc0805-5561861.pdf?src-supplier=Mouser; ComponentLink5URL: https://datasheet.ciiva.com/7941/444164-7941814.pdf?src-supplier=Element14; ComponentLink5Description: https://datasheet.ciiva.com/7941/444164-7941814.pdf?src-supplier=Element14; ComponentLink6URL: https://datasheet.ciiva.com/7941/444164-7941813.pdf?src-supplier=Element14; ComponentLink6Description: https://datasheet.ciiva.com/7941/444164-7941813.pdf?src-supplier=Element14
R4 = RC0805JR-070RL (2): Surface Mount Thick Film Resistor, RC Series, 125 mW, - 5%, 150 V, 0805 [2012 Metric]; Manufacturer: Yageo; Resistance: 0mR; Voltage Rating: 150V; Power Rating: 125mW; Temperature Coefficient: 200ppm/°C; Supplier 1: Future Electronics; Manufacturer Part Number: RC0805JR-070RL; RoHS: Yes; Category: Chip SMD Resistors; Stock 1: 21150000; Pricing 1: 5000=0.00280, 25000=0.00270, 125000=0.00250, 375000=0.00240, 1000000=0.00220 (USD); Case/Package: 0805; Number of Pins: 2; Case Code (Imperial): 0805; Case Code (Metric): 2012; Contact Plating: Tin,Matte; Size Code: 0805; Min Operating Temperature: -55°C; Max Operating Temperature: 155°C; Packaging: Tape and Reel; Tolerance: 5%; Voltage Rating (DC): 150V; Termination: SMD/SMT; Resistor Type: Thick Film; Features: Moisture Resistant; Series: RC; Max Power Dissipation: 125mW; Number of Terminations: 2; Construction: Rectangular; Technology: THICK FILM; Resistance Tolerance: 5%; Length: 2mm; Width: 1.25mm; Height: 0.5mm; Depth: 1.25mm; Radiation Hardening: No; Military Standard: Not; Lead Free: Lead Free; RoHS Compliant: Yes
R8 R19 R20 R23 R25 R30 = RC0805DR-0710K5L: General Purpose Chip Resistor Thick Film 0805 10.5kOhm 0.5% Paper T/R; Manufacturer: Yageo; Resistance: 10.5kR; Max Power Dissipation: 125mW; Temperature Coefficient: 100ppm/°C; Supplier 1: Digi-Key; Manufacturer Part Number: RC0805DR-0710K5L; RoHS: Yes; Category: Chip SMD Resistors; Pricing 1: 5000=0.01264 (USD); Case/Package: 0805; Min Operating Temperature: -55°C; Max Operating Temperature: 155°C; Packaging: Tape and Reel; Resistor Type: Thick Film; Number of Terminations: 2; Tolerance: 0.5%; Features: Moisture Resistant; Length: 0.079inch; Width: 0.049inch; Height: 0.024inch; RoHS Compliant: Yes; ComponentLink1URL: http://www.yageo.com.tw/exep/pages/download/literatures/PYu-R_INT-thick_7.pdf?src-supplier=Digi-Key; ComponentLink1Description: http://www.yageo.com.tw/exep/pages/download/literatures/PYu-R_INT-thick_7.pdf?src-supplier=Digi-Key; Supplier Part Number 1: RC0805DR-0710K5L-ND
R9-R12 R21 R22 R27 = RC0805FR-0722RL: Res Thick Film 0805 22 Ohm 1% 0.125W(1/8W) ±100ppm/C Pad SMD T/R; Manufacturer: Yageo; Power Rating: 125mW; Voltage Rating: 150V; Temperature Coefficient: 100ppm/°C; Supplier 1: Future Electronics; Manufacturer Part Number: RC0805FR-0722RL; RoHS: Yes; Category: Chip SMD Resistors; Stock 1: 390000; Pricing 1: 5000=0.00270, 25000=0.00250, 125000=0.00230, 375000=0.00220, 1000000=0.00210 (USD); Case/Package: 0805; Case Code (Metric): 2012; Case Code (Imperial): 0805; Min Operating Temperature: -55°C; Max Operating Temperature: 155°C; Resistance: 22R; Tolerance: 1%; Packaging: Tape and Reel; Resistor Type: Thick Film; Number of Terminations: 2; Termination: SMD/SMT; Max Power Dissipation: 125mW; Features: Moisture Resistant; Series: RC; Resistance Tolerance: 1%; Construction: Rectangular; Technology: THICK FILM; Package Quantity: 1; Working Voltage: 150V; Length: 0.079inch; Width: 0.049inch; Height: 0.024inch; Depth: 1.25mm; Military Standard: Not; Lead Free: Lead Free; RoHS Compliant: Yes; ComponentLink1URL: https://datasheet.ciiva.com/11819/0900766b8106beab-11819837.pdf?src-supplier=Rs; ComponentLink1Description: https://datasheet.ciiva.com/11819/0900766b8106beab-11819837.pdf?src-supplier=Rs; ComponentLink2URL: https://datasheet.ciiva.com/46447/444164-46447574.pdf?src-supplier=Element14; ComponentLink2Description: https://datasheet.ciiva.com/46447/444164-46447574.pdf?src-supplier=Element14; ComponentLink3URL: https://datasheet.ciiva.com/2457/pyu-r-int-thick-7-2457045.pdf?src-supplier=Digi-Key; ComponentLink3Description: https://datasheet.ciiva.com/2457/pyu-r-int-thick-7-2457045.pdf?src-supplier=Digi-Key; ComponentLink4URL: https://datasheet.ciiva.com/2457/pyu-r-int-thick-7-2457046.pdf?src-supplier=Digi-Key; ComponentLink4Description: https://datasheet.ciiva.com/2457/pyu-r-int-thick-7-2457046.pdf?src-supplier=Digi-Key; ComponentLink5URL: https://datasheet.ciiva.com/2457/pyu-r-int-thick-7-2457044.pdf?src-supplier=Digi-Key; ComponentLink5Description: https://datasheet.ciiva.com/2457/pyu-r-int-thick-7-2457044.pdf?src-supplier=Digi-Key; ComponentLink6URL: https://datasheet.ciiva.com/12667/rc0805-12667371.pdf?src-supplier=Mouser; ComponentLink6Description: https://datasheet.ciiva.com/12667/rc0805-12667371.pdf?src-supplier=Mouser; Supplier Part Number 1: 3012390
R14 R15 = CG0603MLC-05E: ESD Suppressor Multilayer Varistor 5V Automotive 2-Pin Case 0603(1608Metric) T/R; Manufacturer: Bourns; Capacitance: 0.5pF; Voltage Rating (AC): 8V; Number of Channels: 1; Clamping Voltage: 20V; Current Rating: 50nA; Turn-On Delay Time: 1ns; Element Configuration: Single; Supplier 1: Rs; Manufacturer Part Number: CG0603MLC-05E; RoHS: Yes; Category: Varistors; Stock 1: 12500; Case/Package: 0603; Number of Pins: 2; Case Code (Imperial): 0603; Case Code (Metric): 1608; Contact Plating: Tin; Min Operating Temperature: -40°C; Max Operating Temperature: 85°C; Voltage Rating (DC): 5V; Operating Supply Voltage: 5V; Package Quantity: 1; Packaging: Tape and Reel; Termination: SMD/SMT; Voltage: 5V; Number of Circuits: 1; Max Voltage Rating (DC): 5V; Working Voltage: 5V; Leakage Current: 50nA; Series: MLC; Length: 1.6mm; Width: 0.8mm; Depth: 0.8mm; Thickness: 0.8mm; Radiation Hardening: No; Reach SVHC Compliant: Yes; RoHS Compliant: Yes; ComponentLink1URL: https://datasheet.ciiva.com/27747/1163231-27747629.pdf?src-supplier=Jameco; ComponentLink1Description: https://datasheet.ciiva.com/27747/1163231-27747629.pdf?src-supplier=Jameco; ComponentLink2URL: https://datasheet.ciiva.com/30070/mlc-30070503.pdf?src-supplier=Onlinecomponents.com; ComponentLink2Description: https://datasheet.ciiva.com/30070/mlc-30070503.pdf?src-supplier=Onlinecomponents.com; ComponentLink3URL: https://datasheet.ciiva.com/6991/mlc-6991832.pdf?src-supplier=Digi-Key; ComponentLink3Description: https://datasheet.ciiva.com/6991/mlc-6991832.pdf?src-supplier=Digi-Key; ComponentLink4URL: https://datasheet.ciiva.com/6991/mlc-6991834.pdf?src-supplier=Digi-Key; ComponentLink4Description: https://datasheet.ciiva.com/6991/mlc-6991834.pdf?src-supplier=Digi-Key; ComponentLink5URL: https://datasheet.ciiva.com/6991/mlc-6991836.pdf?src-supplier=Digi-Key; ComponentLink5Description: https://datasheet.ciiva.com/6991/mlc-6991836.pdf?src-supplier=Digi-Key; ComponentLink6URL: https://datasheet.ciiva.com/1278/1785244-1278701.pdf?src-supplier=Element14; ComponentLink6Description: https://datasheet.ciiva.com/1278/1785244-1278701.pdf?src-supplier=Element14; Supplier Part Number 1: 1814389
R16 R24 = RC0805DR-071ML: Res General Purpose Thick Film 0805 1M Ohm 0.5% 1/8W ±100ppm/°C Molded Paper T/R; Manufacturer: Yageo; Resistance: 1MR; Max Power Dissipation: 125mW; Supplier 1: Digi-Key; Manufacturer Part Number: RC0805DR-071ML; RoHS: Yes; Category: Chip SMD Resistors; Pricing 1: 5000=0.01264 (USD); Case/Package: 0805; Min Operating Temperature: -55°C; Max Operating Temperature: 155°C; Packaging: Tape and Reel; Resistor Type: Thick Film; Number of Terminations: 2; Tolerance: 0.5%; Temperature Coefficient: 100ppm/°C; Features: Moisture Resistant; Length: 0.079inch; Width: 0.049inch; Height: 0.024inch; RoHS Compliant: Yes; ComponentLink1URL: http://www.yageo.com/NewPortal/_en/search/productDocs.jsp?YageoPartNumber=RC0805DR-071ML&src-supplier=Digi-Key; ComponentLink1Description: http://www.yageo.com/NewPortal/_en/search/productDocs.jsp?YageoPartNumber=RC0805DR-071ML&src-supplier=Digi-Key; Supplier Part Number 1: RC0805DR-071ML-ND
R17 R18 R28 = RC0805FR-071KL: RES SMD 1K OHM 1% 1/8W 0805; Manufacturer: Yageo; Resistance: 1kR; Power Rating: 125mW; Temperature Coefficient: 100ppm/°C; Voltage Rating: 150V; Supplier 1: Future Electronics; Manufacturer Part Number: RC0805FR-071KL; RoHS: Yes; Category: Chip SMD Resistors; Stock 1: 6705000; Pricing 1: 5000=0.00270, 25000=0.00250, 125000=0.00230, 375000=0.00220, 1000000=0.00210 (USD); Case/Package: 0805; Number of Pins: 2; Case Code (Metric): 2012; Case Code (Imperial): 0805; Size Code: 0805; Min Operating Temperature: -55°C; Max Operating Temperature: 155°C; Tolerance: 1%; Packaging: Tape and Reel; Package Quantity: 1; Voltage Rating (DC): 150V; Resistor Type: Thick Film; Number of Terminations: 2; Termination: SMD/SMT; Max Power Dissipation: 125mW; Features: Moisture Resistant; Series: RC; Resistance Tolerance: 1%; Construction: Rectangular; Length: 0.079inch; Width: 0.049inch; Height: 0.024inch; Depth: 1.25mm; Lead Free: Lead Free; Military Standard: Not; RoHS Compliant: Yes; Reach SVHC Compliant: Yes; Supplier Part Number 1: 8126013
SOCKET_FOR_U1 = 4828-3004-CP: Socket DIP 28Cnts DualWipe 0.3InSpc. PhosphorBronze Nickel KinkedTail 4800Series; Manufacturer: 3M; Insulation Resistance: 5GR; Number of Positions: 28; Current Rating: 1A; Gender: Female; Pitch: 2.54mm; Row Spacing: 7.62mm; Supplier 1: Avnet; Manufacturer Part Number: 4828-3004-CP; RoHS: Yes; Category: Connectors; Stock 1: 5731; Pricing 1: 1=1.07000, 10=0.93600, 25=0.88100, 50=0.84500, 100=0.80800, 250=0.73500, 500=0.66200 (USD); Mount: Through Hole; Contact Plating: Tin; Contact Material: Bronze; Housing Material: Glass; Insulation Material: Polyester; Contact Finish - Mating: TIN; Min Operating Temperature: -25°C; Max Operating Temperature: 85°C; Package Quantity: 5600; Number of Rows: 2; Termination: Solder; Connector Type: DIP; Number of Contacts: 28; Orientation: Straight; Series: 4800; Packaging: Rail/Tube; Length: 35.43mm; Width: 10.16mm; Depth: 10.16mm; Lead Free: Lead Free; RoHS Compliant: Yes; Flammability Rating: UL94 V-0; ComponentLink1URL: https://datasheet.ciiva.com/768/ts1099-768354.pdf?src-supplier=Digi-Key; ComponentLink1Description: https://datasheet.ciiva.com/768/ts1099-768354.pdf?src-supplier=Digi-Key; Supplier Part Number 1: 34P8056
SW1 SW2 = 1825910-6: Switch Tactile OFF (ON) SPST Round Button PC Pins 0.05A 24VDC 1.57N Thru-Hole Loose; Manufacturer: TE Connectivity Alcoswitch; Mechanical Life: 100000Cycles; Actuator Material: PBT; Actuator Color: Black; Max Current Rating: 50mA; Operating Force: 160gf; Max Voltage Rating (DC): 24V; Contact Resistance: 100mR; Illumination Type: Non-Illuminated,Illuminated; Switch Travel: 0.25mm; Switch Function: Off-Mom; Actuator Type: Standard; Actuator Length: 0.055inch; Supplier 1: Rs; Manufacturer Part Number: 1825910-6; RoHS: Yes; Category: Pushbutton Switches; Stock 1: 8250; Mount: Through Hole; Contact Material: Copper Alloy; Contact Plating: Silver; Min Operating Temperature: -35°C; Max Operating Temperature: 85°C; Package Quantity: 750; Packaging: Loose Piece; Throw Configuration: SPST; Termination: PC Pins; Electrical Life: 100000Cycles; Orientation: Straight; Contact Current Rating: 50mA; Type: Switch; Series: FSMJ; Length: 5.99mm; RoHS Compliant: Yes; ELV: Compliant; Lead Free: Lead Free; ComponentLink1URL: https://datasheet.ciiva.com/30199/1825910-6rqpn1825910-6-30199520.pdf?src-supplier=Onlinecomponents.com; ComponentLink1Description: https://datasheet.ciiva.com/30199/1825910-6rqpn1825910-6-30199520.pdf?src-supplier=Onlinecomponents.com; ComponentLink2URL: https://datasheet.ciiva.com/15184/getdatasheetpartid-395915-15184509.pdf?src-supplier=Verical; ComponentLink2Description: https://datasheet.ciiva.com/15184/getdatasheetpartid-395915-15184509.pdf?src-supplier=Verical; Supplier Part Number 1: 1613779
U1 = ATMEGA328-PU: ATmega Series 32 kB Flash 2 kB SRAM 20 MHz 8-Bit Microcontroller - DIP-28; Manufacturer: Microchip; Core Architecture: AVR; RAM Size: 2KB; Interface: SPI,USART,2-Wire,I2C,UART; Number of I/Os: 23; Number of Timers/Counters: 3; Max Supply Voltage: 5.5V; Min Supply Voltage: 1.8V; Frequency: 20MHz; Number of PWM Channels: 6; Data Bus Width: 8b; Oscillator Type: Internal; Number of SPI Channels: 1; Watchdog Timer: Yes; Memory Size: 32KB; Peripherals: POR,PWM,WDT; Supplier 1: Rs; Manufacturer Part Number: ATMEGA328-PU; RoHS: Yes; Stock 1: 515; Mount: Through Hole; Case/Package: PDIP; Number of Pins: 28; Contact Plating: Tin,Matte; Min Operating Temperature: -40°C; Max Operating Temperature: 85°C; Package Quantity: 14; Series: AVR® ATmega; Packaging: Rail/Tube; Number of ADC Channels: 6; Number of Programmable I/O: 23; Max Frequency: 20MHz; Number of I2C Channels: 1; Memory Type: FLASH; Length: 34.8mm; Width: 7.49mm; Height: 4.572mm; Radiation Hardening: No; Reach SVHC Compliant: Yes; Lead Free: Lead Free; RoHS Compliant: Yes; ComponentLink1URL: https://datasheet.ciiva.com/1157/1684409-1157692.pdf?src-supplier=Element14; ComponentLink1Description: https://datasheet.ciiva.com/1157/1684409-1157692.pdf?src-supplier=Element14; Supplier Part Number 1: 1310277
U2 = ATMEGA16U2: 8-bit AVR MCU, 16 KB, 512 Bytes, 16 MHz, 2.7 to 5.5V, TQFP-32, RoHS; Manufacturer: Microchip; Manufacturer Part Number: ATMEGA16U2-AUR; Data Bus Width: 8b; Frequency: 16MHz; RAM Size: 512B; Min Supply Voltage: 2.7V; Interface: SPI,USB,USART; Number of Timers/Counters: 2; Number of Programmable I/O: 22; Watchdog Timer: Yes; Memory Type: FLASH; Memory Size: 16KB; Supplier 1: Digi-Key; RoHS: Yes; Category: Uncategorized; Stock 1: 24698; Pricing 1: 1=3.59000, 25=3.28920, 100=2.98500 (USD); Mount: Surface Mount; Case/Package: LQFP; Number of Pins: 32; Contact Plating: Tin,Matte; Min Operating Temperature: -40°C; Max Operating Temperature: 85°C; Package Quantity: 2000; Core Architecture: AVR; Max Supply Voltage: 5.5V; Packaging: Tape and Reel; Max Frequency: 16MHz; RoHS Compliant: Yes; ComponentLink1URL: https://datasheet.ciiva.com/9234/doc7799-9234702.pdf?src-supplier=Avnet; ComponentLink1Description: https://datasheet.ciiva.com/9234/doc7799-9234702.pdf?src-supplier=Avnet; Supplier Part Number 1: ATMEGA16U2-AURCT-ND
U3 = TL1963A-33DCQR: LDO Regulator Pos 3.3V 1.5A 6-Pin(5+Tab) SOT-223 T/R; Manufacturer: Texas Instruments; Dropout Voltage: 340mV; Number of Outputs: 1; Max Input Voltage: 20V; Min Input Voltage: 2.1V; Min Current Limit: 1.6A; Input Bias Current: 1mA; Polarity: Positive; Accuracy: 3%; Output Type: Fixed; Supplier 1: Arrow Electronics; Manufacturer Part Number: TL1963A-33DCQR; RoHS: Yes; Category: Voltage Regulators - Linear; Stock 1: 1480; Pricing 1: 1=3.74100, 10=3.37760, 25=3.21650, 100=2.87270, 250=2.75080, 500=2.54380, 1000=2.39660 (USD); Case/Package: SOT-223; Number of Pins: 6; Contact Plating: Gold; Min Operating Temperature: -40°C; Max Operating Temperature: 125°C; Package Quantity: 1; Packaging: Tape and Reel; Output Voltage: 3.3V; Output Current: 1.5A; Max Output Current: 1.5A; Number of Regulators: 1; Quiescent Current: 1mA; Max Output Voltage: 3.3V; Min Output Voltage: 3.3V; Series: -; Radiation Hardening: No; Lead Free: Lead Free; RoHS Compliant: Yes; ComponentLink1URL: https://datasheet.ciiva.com/2046/tl1963a-2046162.pdf?src-supplier=Digi-Key; ComponentLink1Description: https://datasheet.ciiva.com/2046/tl1963a-2046162.pdf?src-supplier=Digi-Key; ComponentLink2URL: https://datasheet.ciiva.com/2046/tl1963a-2046161.pdf?src-supplier=Digi-Key; ComponentLink2Description: https://datasheet.ciiva.com/2046/tl1963a-2046161.pdf?src-supplier=Digi-Key; ComponentLink3URL: https://datasheet.ciiva.com/2046/tl1963a-2046163.pdf?src-supplier=Digi-Key; ComponentLink3Description: https://datasheet.ciiva.com/2046/tl1963a-2046163.pdf?src-supplier=Digi-Key; Supplier Part Number 1: TL1963A-33DCQR
U4-U7 = SN74AHC1G09DBVR: Single 2-input, 2-V to 5.5-V AND gate with open-drain outputs 5-SOT-23 -55 to 125; Manufacturer: Texas Instruments; Min Supply Voltage: 2V; Max Supply Voltage: 5.5V; Quiescent Current: 1uA; Number of Inputs: 2; Propagation Delay: 7.5ns; Output Current: 25mA; Number of Circuits: 1; Low Level Output Current: 8mA; Supplier 1: Mouser; Manufacturer Part Number: SN74AHC1G09DBVR; RoHS: Yes; Category: Logic Gates; Stock 1: 32059; Pricing 1: 1=0.49000, 10=0.26700, 50=0.26700, 100=0.17100, 1000=0.10600, 10000=0.07500 (USD); Mount: Surface Mount; Case/Package: SOT-23; Number of Pins: 5; Contact Plating: Tin,Matte; Min Operating Temperature: -55°C; Max Operating Temperature: 125°C; Logic Function: AND GATE; Package Quantity: 3000; Packaging: Tape and Reel; Number of Gates: 1; Number of Elements: 1; Number of Bits: 1; Series: 74AHC; Technology: CMOS; Output Voltage: 5.5V; Number of Outputs: 1; Radiation Hardening: No; Reach SVHC Compliant: Yes; Lead Free: Lead Free; RoHS Compliant: Yes; ComponentLink1URL: https://datasheet.ciiva.com/1864/sn74ahc1g09-1864411.pdf?src-supplier=Digi-Key; ComponentLink1Description: https://datasheet.ciiva.com/1864/sn74ahc1g09-1864411.pdf?src-supplier=Digi-Key; ComponentLink2URL: https://datasheet.ciiva.com/1864/sn74ahc1g09-1864410.pdf?src-supplier=Digi-Key; ComponentLink2Description: https://datasheet.ciiva.com/1864/sn74ahc1g09-1864410.pdf?src-supplier=Digi-Key; ComponentLink3URL: https://datasheet.ciiva.com/1864/sn74ahc1g09-1864412.pdf?src-supplier=Digi-Key; ComponentLink3Description: https://datasheet.ciiva.com/1864/sn74ahc1g09-1864412.pdf?src-supplier=Digi-Key; Supplier Part Number 1: 595-SN74AHC1G09DBVR